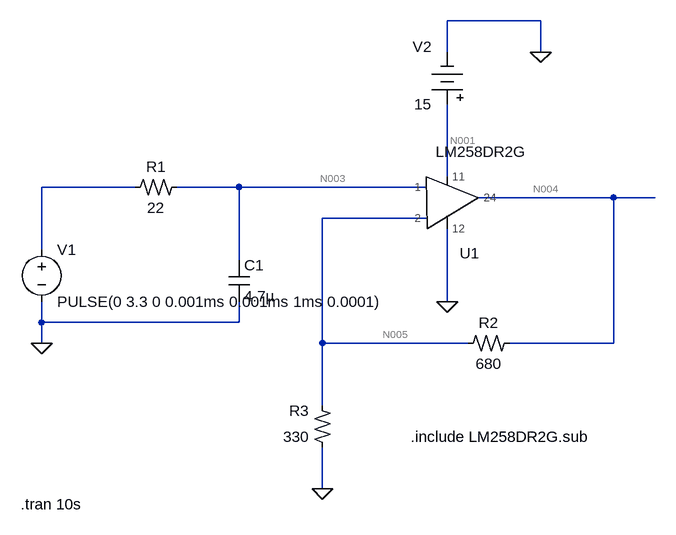
[diagram p0: schematic 3.3 to 10DC(main capacity).asc]
3.3 to 10DC(main capacity).asc, the LTspice schematic file:
Version 4
SHEET 1 1012 680
WIRE 832 -192 688 -192
WIRE 688 -144 688 -192
WIRE 832 -144 832 -192
WIRE 688 48 688 -64
WIRE 208 64 64 64
WIRE 368 64 272 64
WIRE 656 64 368 64
WIRE 944 80 736 80
WIRE 1008 80 944 80
WIRE 656 112 496 112
WIRE 64 160 64 64
WIRE 368 176 368 64
WIRE 688 240 688 128
WIRE 64 272 64 240
WIRE 368 272 368 240
WIRE 368 272 64 272
WIRE 64 304 64 272
WIRE 496 304 496 112
WIRE 720 304 496 304
WIRE 944 304 944 80
WIRE 944 304 784 304
WIRE 496 400 496 304
WIRE 496 528 496 464
FLAG 64 304 0
FLAG 496 528 0
FLAG 688 240 0
FLAG 832 -144 0
SYMBOL voltage 64 144 R0
WINDOW 123 0 0 Left 0
WINDOW 39 0 0 Left 0
SYMATTR InstName V1
SYMATTR Value PULSE(0 3.3 0 0.001ms 0.001ms 1ms 0.0001)
SYMBOL res2 272 48 R90
WINDOW 0 0 32 VBottom 2
WINDOW 3 32 32 VTop 2
SYMATTR InstName R1
SYMATTR Value 22
SYMBOL res2 784 288 R90
WINDOW 0 0 32 VBottom 2
WINDOW 3 32 32 VTop 2
SYMATTR InstName R2
SYMATTR Value 680
SYMBOL res2 512 464 R180
WINDOW 0 36 56 Left 2
WINDOW 3 36 16 Left 2
SYMATTR InstName R3
SYMATTR Value 330
SYMBOL cap 352 176 R0
SYMATTR InstName C1
SYMATTR Value 4.7µ
SYMBOL LM258DR2G 512 80 M180
SYMATTR InstName U1
SYMBOL Misc\\battery 688 -48 R180
WINDOW 0 24 104 Left 2
WINDOW 3 24 16 Left 2
WINDOW 123 0 0 Left 0
WINDOW 39 0 0 Left 0
SYMATTR InstName V2
SYMATTR Value 15
TEXT 632 448 Left 2 !.include LM258DR2G.sub
TEXT 32 552 Left 2 !.tran 10s

The netlist it stands for:
* 3.3 to 10DC(main capacity).asc
V1 N002 0 PULSE(0 3.3 0 0.001ms 0.001ms 1ms 0.0001)
R1 N003 N002 22
R2 N004 N005 680
R3 0 N005 330
C1 N003 0 4.7µ
XU1 N003 N005 N001 0 N004 LM258DR2G  ; pins 1 2 11 12 24
V2 N001 0 15
.include LM258DR2G.sub
.tran 10s
.lib H:\D5\Interface\Ltspice Model\LM258DR2G.sub
.backanno
.end

* Results of the author's LTspice run, read from the files saved beside the schematic
* Operating Point, zero values left out:
*   V(n003) = 1.065 µV
*   V(n004) = 7.134 mV
*   V(n005) = 2.34 mV
*   V(n001) = 15 V
*   I(R3) = -7.091 µA
*   I(R2) = 7.05 µA
*   I(R1) = 48.41 nA
*   I(V2) = 620.9 µA
*   I(V1) = 48.41 nA
*   Ix(u1:1) = -48.41 nA
*   Ix(u1:2) = -40.37 nA
*   Ix(u1:11) = -620.9 µA
*   Ix(u1:12) = -1.124 mA
*   Ix(u1:24) = -7.05 µA